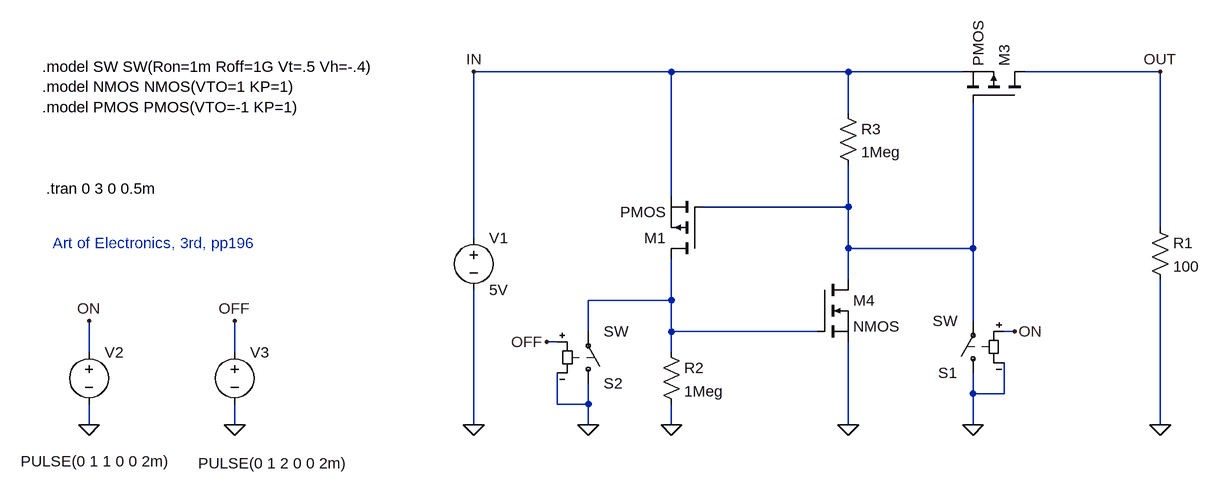
[diagram p0: schematic latch_01.asc]
latch_01.asc, the LTspice schematic file:
Version 4
SHEET 1 1460 680
WIRE 288 -144 -16 -144
WIRE 560 -144 288 -144
WIRE 736 -144 560 -144
WIRE 1040 -144 832 -144
WIRE 560 -80 560 -144
WIRE 288 48 288 -144
WIRE 560 64 560 0
WIRE 560 64 336 64
WIRE 1040 96 1040 -144
WIRE -16 112 -16 -144
WIRE 560 128 560 64
WIRE 752 128 752 -96
WIRE 752 128 560 128
WIRE 560 176 560 128
WIRE 288 208 288 144
WIRE 288 208 160 208
WIRE 752 240 752 128
WIRE 160 256 160 208
WIRE 288 256 288 208
WIRE 512 256 288 256
WIRE 816 256 800 256
WIRE 112 272 96 272
WIRE -608 288 -608 240
WIRE -384 288 -384 240
WIRE 288 288 288 256
WIRE 752 352 752 320
WIRE 800 352 800 304
WIRE 800 352 752 352
WIRE 112 368 112 320
WIRE 160 368 160 336
WIRE 160 368 112 368
WIRE -608 400 -608 368
WIRE -384 400 -384 368
WIRE -16 400 -16 192
WIRE 160 400 160 368
WIRE 288 400 288 368
WIRE 560 400 560 272
WIRE 752 400 752 352
WIRE 1040 400 1040 176
FLAG -16 400 0
FLAG 1040 400 0
FLAG 288 400 0
FLAG 560 400 0
FLAG 752 400 0
FLAG 160 400 0
FLAG -608 400 0
FLAG -384 400 0
FLAG -608 240 ON
FLAG -384 240 OFF
FLAG 1040 -144 OUT
FLAG -16 -144 IN
FLAG 816 256 ON
FLAG 96 272 OFF
SYMBOL voltage -16 96 R0
SYMATTR InstName V1
SYMATTR Value 5V
SYMBOL res 1024 80 R0
SYMATTR InstName R1
SYMATTR Value 100
SYMBOL res 272 272 R0
SYMATTR InstName R2
SYMATTR Value 1Meg
SYMBOL res 544 -96 R0
SYMATTR InstName R3
SYMATTR Value 1Meg
SYMBOL sw 752 336 R180
SYMATTR InstName S1
SYMBOL sw 160 352 M180
SYMATTR InstName S2
SYMBOL voltage -608 272 R0
WINDOW 3 -105 184 Left 2
WINDOW 123 0 0 Left 0
WINDOW 39 0 0 Left 0
SYMATTR InstName V2
SYMATTR Value PULSE(0 1 1 0 0 2m)
SYMBOL voltage -384 272 R0
WINDOW 3 -56 187 Left 2
WINDOW 123 0 0 Left 0
WINDOW 39 0 0 Left 0
SYMATTR InstName V3
SYMATTR Value PULSE(0 1 2 0 0 2m)
SYMBOL pmos 832 -96 M270
SYMATTR InstName M3
SYMBOL pmos 336 144 R180
SYMATTR InstName M1
SYMBOL nmos 512 176 R0
SYMATTR InstName M4
TEXT -680 -152 Left 2 !.model SW SW(Ron=1m Roff=1G Vt=.5 Vh=-.4)\n.model NMOS NMOS(VTO=1 KP=1)\n.model PMOS PMOS(VTO=-1 KP=1)
TEXT -674 36 Left 2 !.tran 0 3 0 0.5m
TEXT -664 120 Left 2 ;Art of Electronics, 3rd, pp196

The netlist it stands for:
* latch_01.asc
V1 IN 0 5V
R1 OUT 0 100
R2 N002 0 1Meg
R3 IN N001 1Meg
S1 0 N001 ON 0 SW
S2 0 N002 OFF 0 SW
V2 ON 0 PULSE(0 1 1 0 0 2m)
V3 OFF 0 PULSE(0 1 2 0 0 2m)
M3 OUT N001 IN IN PMOS
M1 N002 N001 IN IN PMOS
M4 N001 N002 0 0 NMOS
.model NMOS NMOS
.model PMOS PMOS
.lib standard.mos
.model SW SW(Ron=1m Roff=1G Vt=.5 Vh=-.4)
.model NMOS NMOS(VTO=1 KP=1)
.model PMOS PMOS(VTO=-1 KP=1)
.tran 0 3 0 0.5m
* Art of Electronics, 3rd, pp196
.backanno
.end